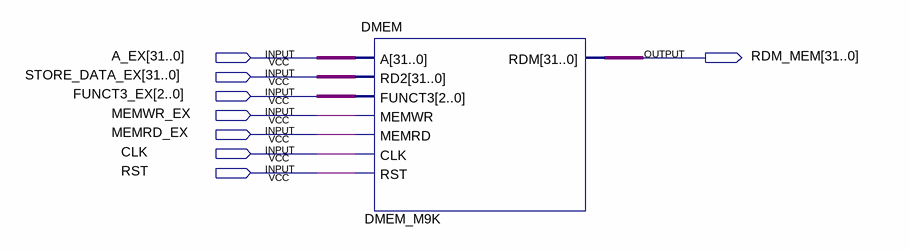
[diagram p0: schematic sheet]
// Quartus schematic memory.bdf as structural Verilog: 1 symbols, 8 pins
module memory (
  input  [31:0] A_EX,
  input  [31:0] STORE_DATA_EX,
  input  [2:0] FUNCT3_EX,
  input  MEMWR_EX,
  input  MEMRD_EX,
  input  CLK,
  input  RST,
  output [31:0] RDM_MEM
);

  DMEM DMEM_M9K (
    .A(A_EX), .RD2(STORE_DATA_EX), .FUNCT3(FUNCT3_EX), .MEMWR(MEMWR_EX), .MEMRD(MEMRD_EX), .CLK(CLK),
    .RST(RST), .RDM(RDM_MEM));
endmodule
